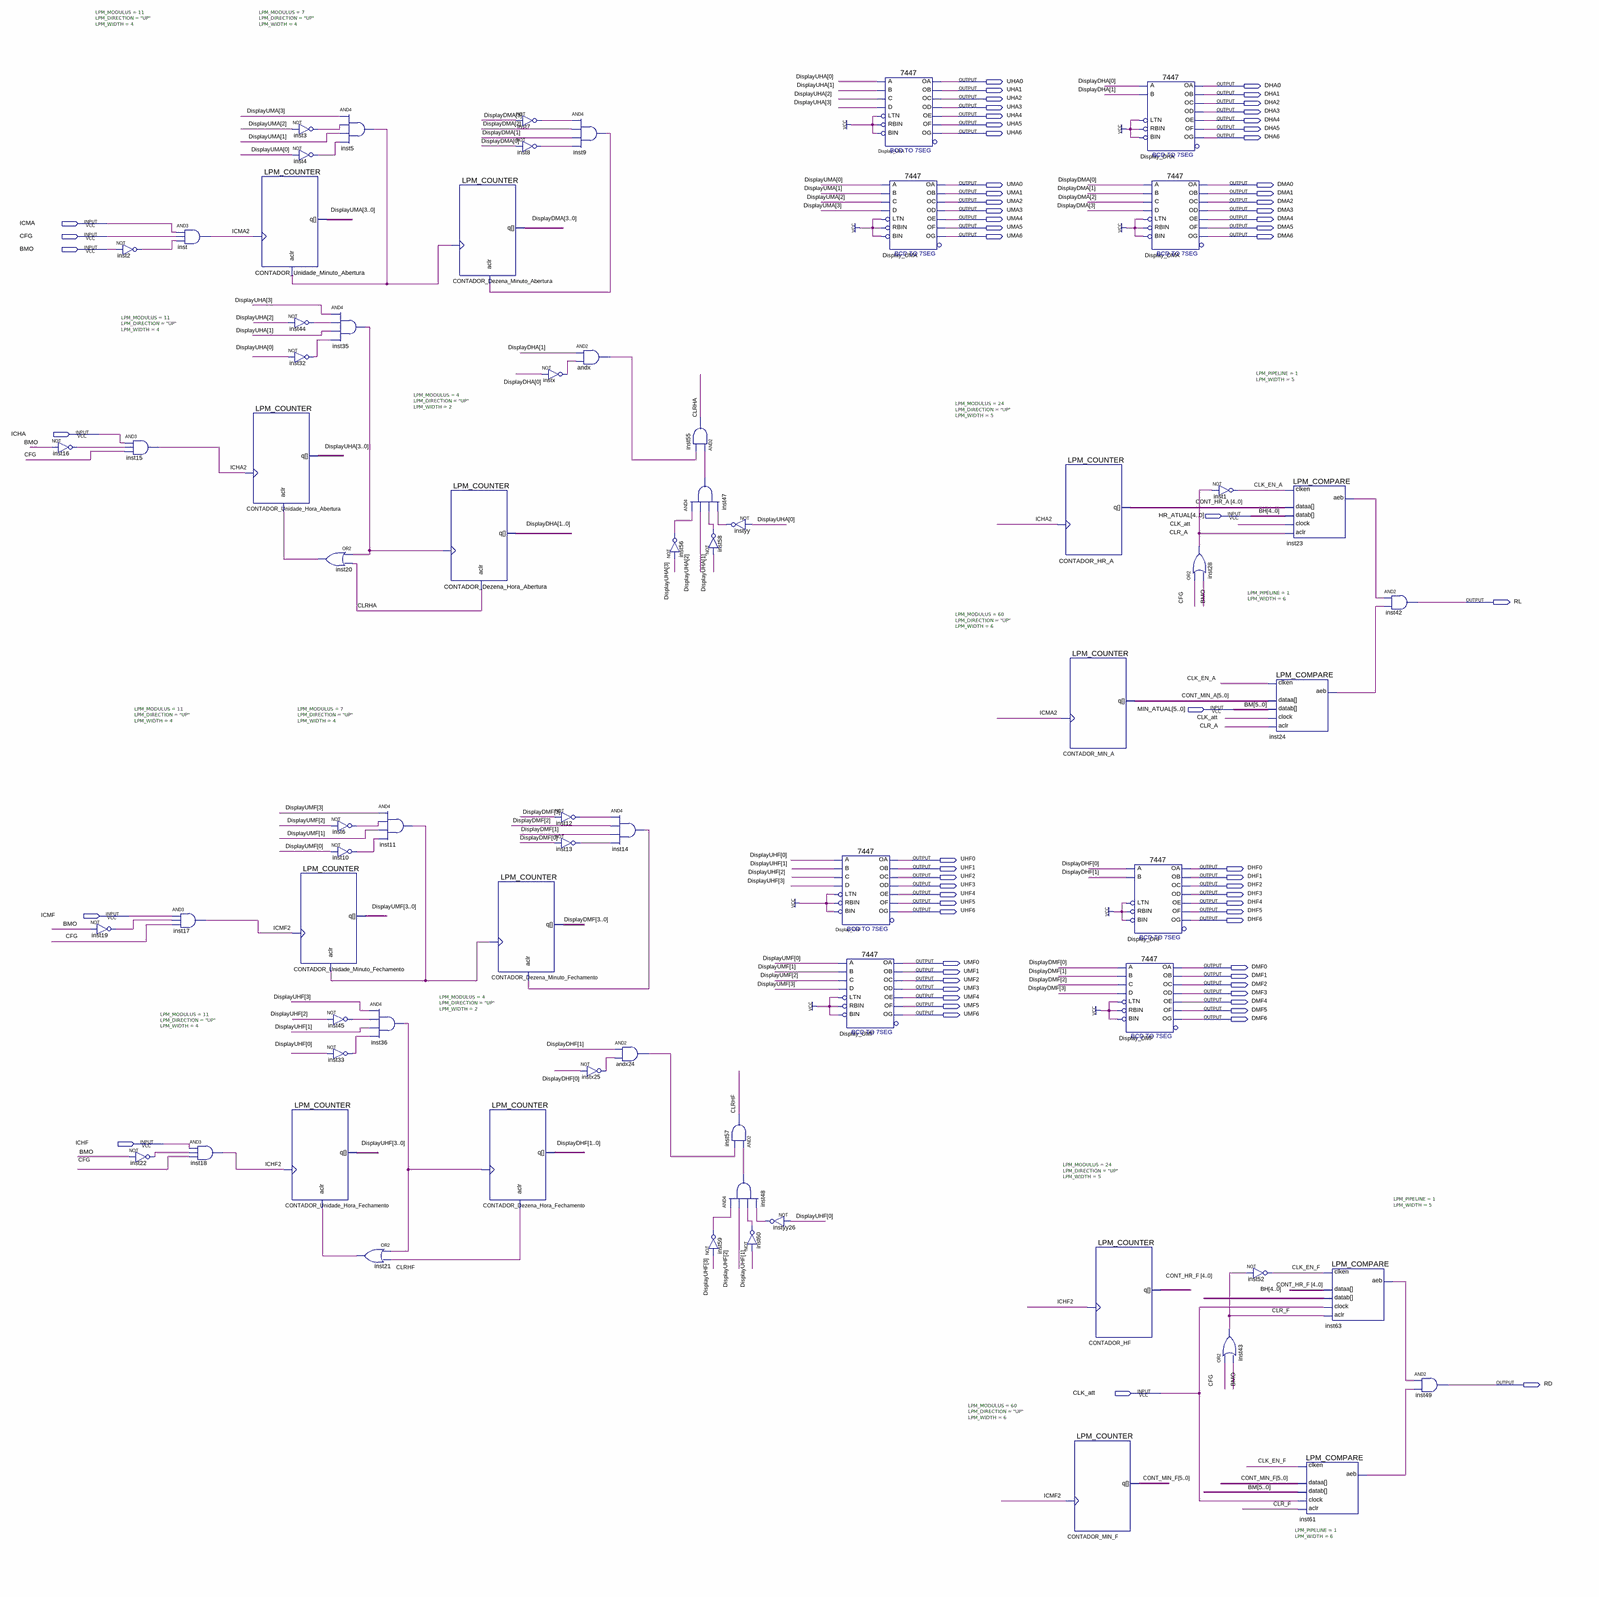
[diagram p0: schematic sheet, whole]
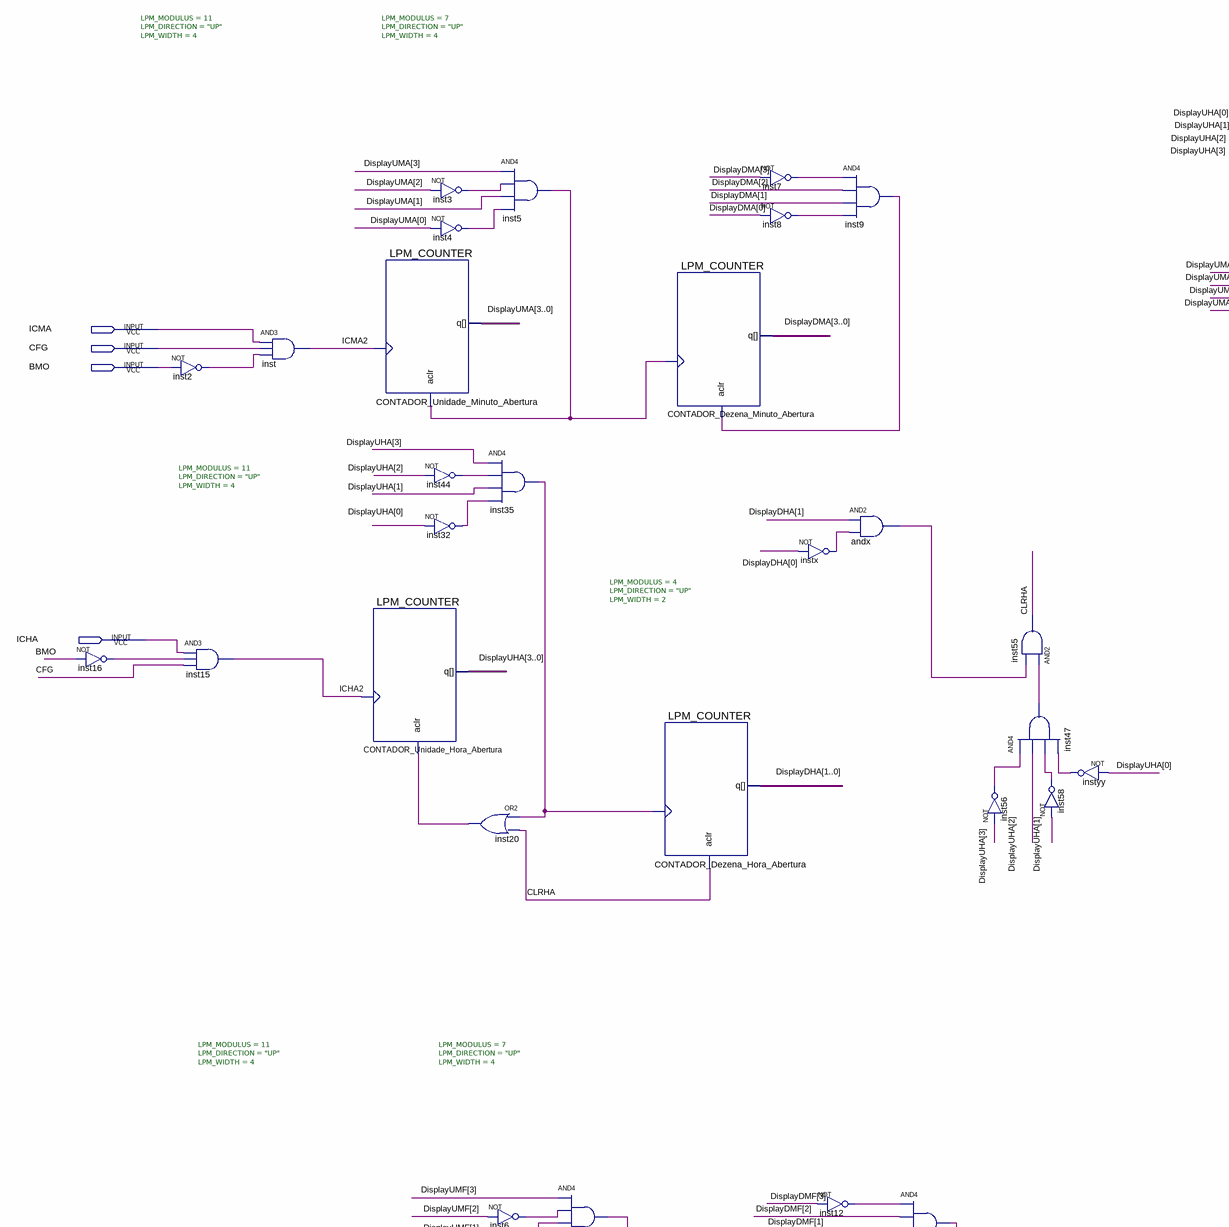
[diagram p1: schematic sheet, upper left part]
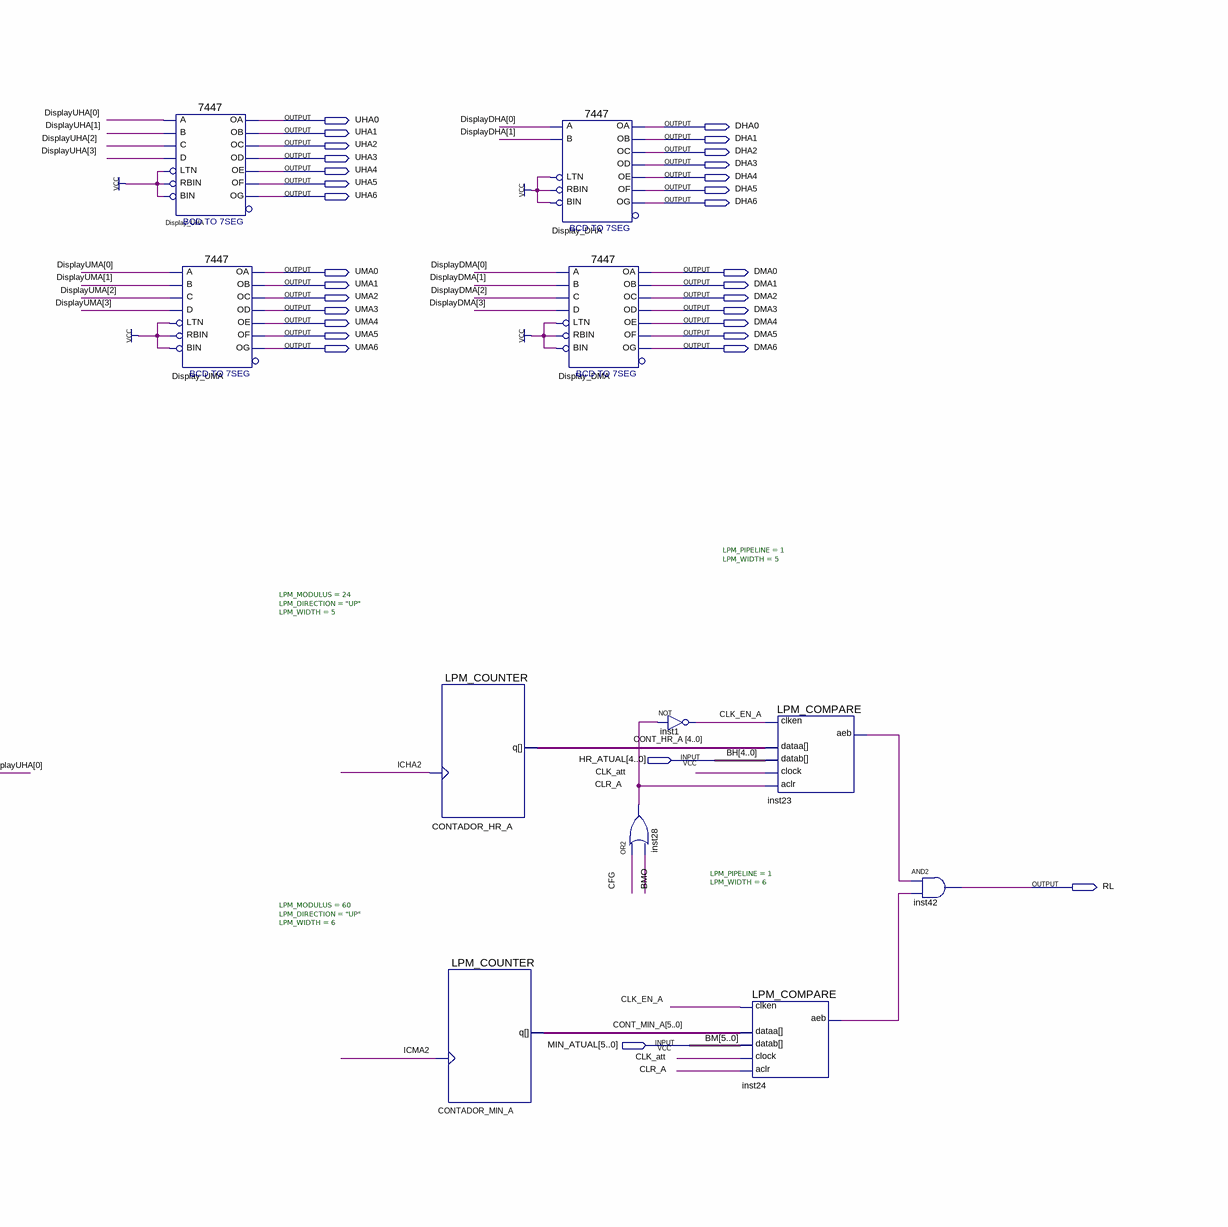
[diagram p2: schematic sheet, upper right part]
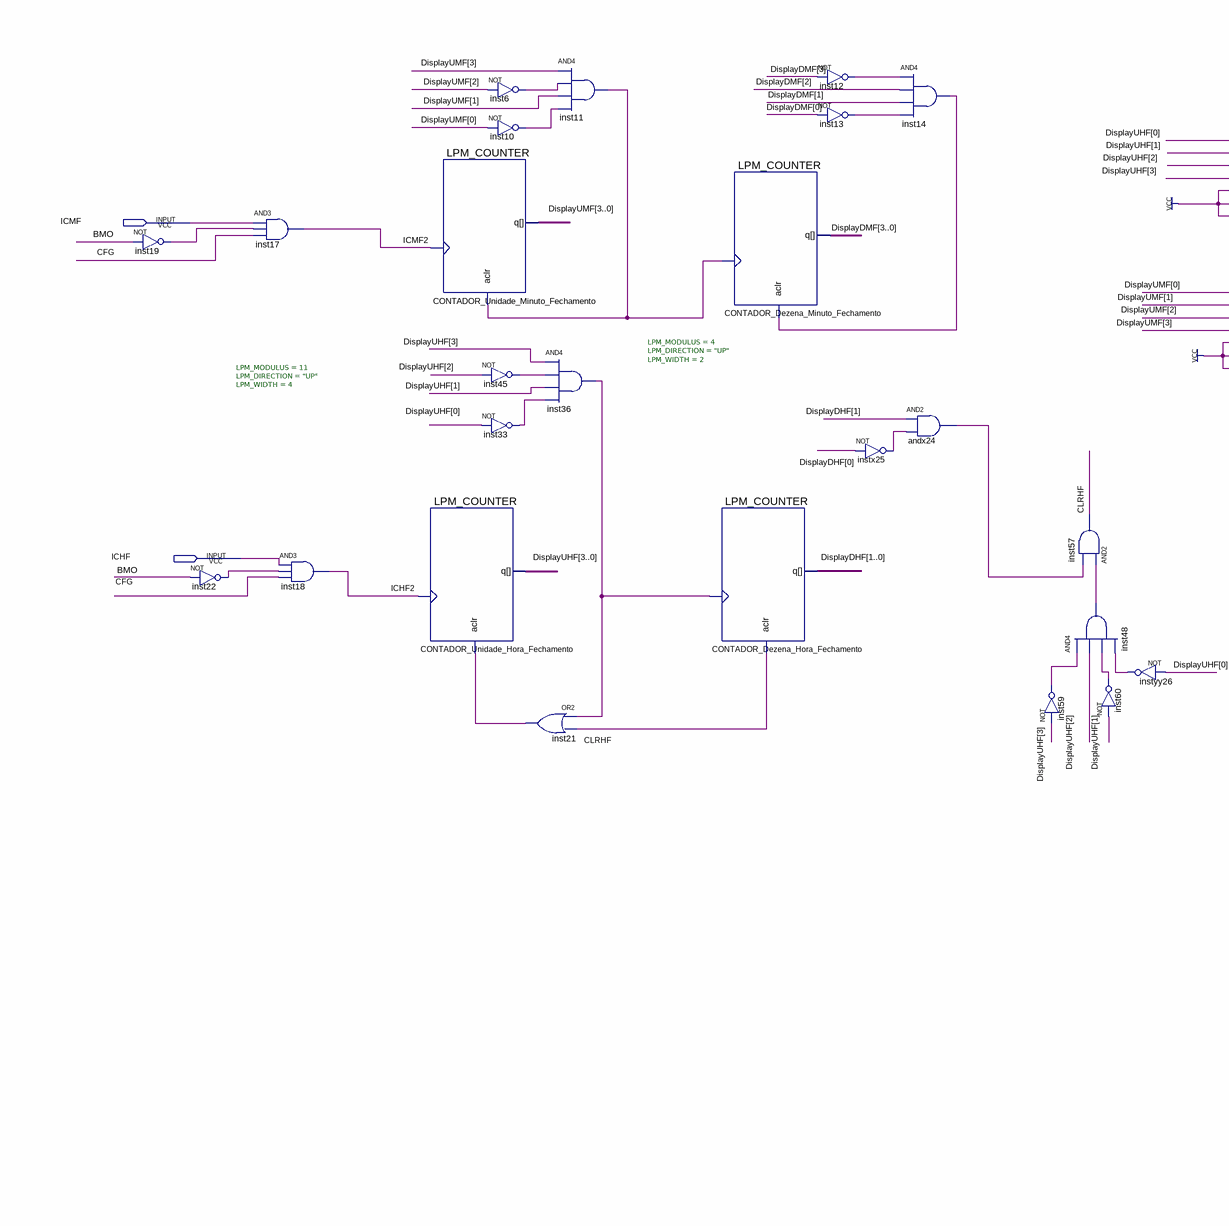
[diagram p3: schematic sheet, lower left part]
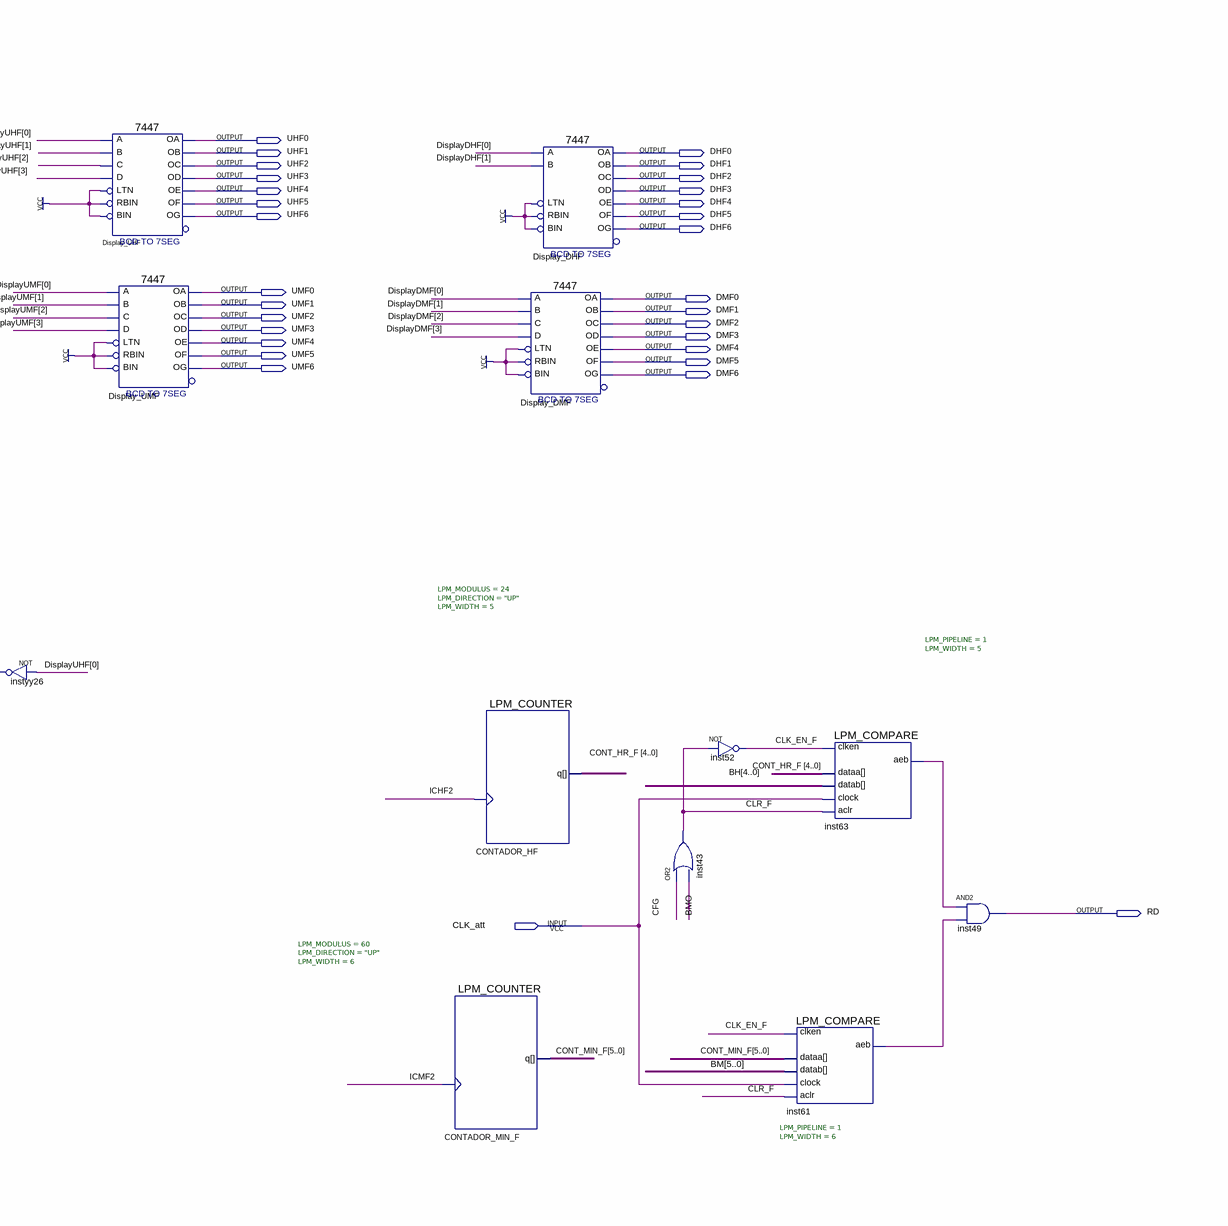
[diagram p4: schematic sheet, lower right part]
// Quartus schematic circuitoAutomatico.bdf as structural Verilog: 72 symbols, 67 pins
module circuitoAutomatico (
  input  ICMA,
  input  CFG,
  input  BMO,
  input  ICHA,
  input  [4:0] HR_ATUAL,
  input  [5:0] MIN_ATUAL,
  input  ICMF,
  input  ICHF,
  input  CLK_att,
  output UHA0,
  output DHA0,
  output UHA1,
  output DHA1,
  output UHA2,
  output DHA2,
  output UHA3,
  output DHA3,
  output UHA4,
  output DHA4,
  output UHA5,
  output DHA5,
  output UHA6,
  output DHA6,
  output UMA0,
  output DMA0,
  output UMA1,
  output DMA1,
  output UMA2,
  output DMA2,
  output UMA3,
  output DMA3,
  output UMA4,
  output DMA4,
  output UMA5,
  output DMA5,
  output UMA6,
  output DMA6,
  output RL,
  output UHF0,
  output UHF1,
  output DHF0,
  output UHF2,
  output DHF1,
  output UHF3,
  output DHF2,
  output UHF4,
  output DHF3,
  output UHF5,
  output DHF4,
  output UHF6,
  output DHF5,
  output DHF6,
  output UMF0,
  output DMF0,
  output UMF1,
  output DMF1,
  output UMF2,
  output DMF2,
  output UMF3,
  output DMF3,
  output UMF4,
  output DMF4,
  output UMF5,
  output DMF5,
  output UMF6,
  output DMF6,
  output RD
);

  wire andx24_out, andx_out, CLK_EN_A, CLK_EN_F, CLR_A, CLR_F, CLRHA, CLRHF, ICHA2, ICHF2, ICMA2, ICMF2,
       inst2_out, inst3_out, inst4_out, inst5_out, inst6_out, inst7_out, inst8_out, inst9_out, inst10_out,
       inst11_out, inst12_out, inst13_out, inst14_out, inst16_out, inst19_out, inst20_out, inst21_out,
       inst22_out, inst23_aeb, inst24_aeb, inst32_out, inst33_out, inst35_out, inst36_out, inst44_out,
       inst45_out, inst47_out, inst48_out, inst56_out, inst58_out, inst59_out, inst60_out, inst61_aeb,
       inst63_aeb, instx25_out, instx_out, instyy26_out, instyy_out;
  wire [1:0] DisplayDHA, DisplayDHF;
  wire [3:0] DisplayDMA, DisplayDMF, DisplayUHA, DisplayUHF, DisplayUMA, DisplayUMF;
  wire [4:0] CONT_HR_A, CONT_HR_F;
  wire [5:0] CONT_MIN_A, CONT_MIN_F;

  not inst16 (inst16_out, BMO);
  not inst19 (inst19_out, BMO);
  not inst2 (inst2_out, BMO);
  and inst15 (ICHA2, ICHA, inst16_out, CFG);
  not inst22 (inst22_out, BMO);
  and inst (ICMA2, ICMA, CFG, inst2_out);
  and inst17 (ICMF2, ICMF, inst19_out, CFG);
  and inst18 (ICHF2, ICHF, inst22_out, CFG);
  LPM_COUNTER #(.LPM_MODULUS(11), .LPM_DIRECTION("UP"), .LPM_WIDTH(4)) CONTADOR_Unidade_Hora_Abertura (
    .aclr(inst20_out), .clock(ICHA2), .q(DisplayUHA));
  LPM_COUNTER #(.LPM_MODULUS(11), .LPM_DIRECTION("UP"), .LPM_WIDTH(4)) CONTADOR_Unidade_Minuto_Abertura (
    .aclr(inst5_out), .clock(ICMA2), .q(DisplayUMA));
  LPM_COUNTER #(.LPM_MODULUS(11), .LPM_DIRECTION("UP"), .LPM_WIDTH(4)) CONTADOR_Unidade_Hora_Fechamento (
    .aclr(inst21_out), .clock(ICHF2), .q(DisplayUHF));
  not inst3 (inst3_out, DisplayUMA[2]);
  not inst4 (inst4_out, DisplayUMA[0]);
  not inst44 (inst44_out, DisplayUHA[2]);
  not inst32 (inst32_out, DisplayUHA[0]);
  or inst20 (inst20_out, inst35_out, CLRHA);
  LPM_COUNTER #(.LPM_MODULUS(11), .LPM_DIRECTION("UP"), .LPM_WIDTH(4)) CONTADOR_Unidade_Minuto_Fechamento (
    .aclr(inst11_out), .clock(ICMF2), .q(DisplayUMF));
  and inst5 (inst5_out, DisplayUMA[3], inst3_out, DisplayUMA[1], inst4_out);
  and inst35 (inst35_out, DisplayUHA[3], inst44_out, DisplayUHA[1], inst32_out);
  not inst6 (inst6_out, DisplayUMF[2]);
  not inst10 (inst10_out, DisplayUMF[0]);
  not inst45 (inst45_out, DisplayUHF[2]);
  not inst33 (inst33_out, DisplayUHF[0]);
  and inst11 (inst11_out, DisplayUMF[3], inst6_out, DisplayUMF[1], inst10_out);
  and inst36 (inst36_out, DisplayUHF[3], inst45_out, DisplayUHF[1], inst33_out);
  or inst21 (inst21_out, inst36_out, CLRHF);
  LPM_COUNTER #(.LPM_MODULUS(7), .LPM_DIRECTION("UP"), .LPM_WIDTH(4)) CONTADOR_Dezena_Minuto_Abertura (
    .aclr(inst9_out), .clock(inst5_out), .q(DisplayDMA));
  LPM_COUNTER #(.LPM_MODULUS(4), .LPM_DIRECTION("UP"), .LPM_WIDTH(2)) CONTADOR_Dezena_Hora_Abertura (
    .aclr(CLRHA), .clock(inst35_out), .q(DisplayDHA));
  LPM_COUNTER #(.LPM_MODULUS(7), .LPM_DIRECTION("UP"), .LPM_WIDTH(4)) CONTADOR_Dezena_Minuto_Fechamento (
    .aclr(inst14_out), .clock(inst11_out), .q(DisplayDMF));
  LPM_COUNTER #(.LPM_MODULUS(4), .LPM_DIRECTION("UP"), .LPM_WIDTH(2)) CONTADOR_Dezena_Hora_Fechamento (
    .aclr(CLRHF), .clock(inst36_out), .q(DisplayDHF));
  not inst7 (inst7_out, DisplayDMA[3]);
  not inst8 (inst8_out, DisplayDMA[0]);
  not instx (instx_out, DisplayDHA[0]);
  not inst12 (inst12_out, DisplayDMF[3]);
  not inst13 (inst13_out, DisplayDMF[0]);
  and inst9 (inst9_out, inst7_out, DisplayDMA[2], DisplayDMA[1], inst8_out);
  and andx (andx_out, DisplayDHA[1], instx_out);
  not instx25 (instx25_out, DisplayDHF[0]);
  and inst14 (inst14_out, inst12_out, DisplayDMF[2], DisplayDMF[1], inst13_out);
  and andx24 (andx24_out, DisplayDHF[1], instx25_out);
  and inst55 (CLRHA, inst47_out, andx_out);
  and inst47 (inst47_out, inst56_out, DisplayUHA[2], inst58_out, instyy_out);
  not inst56 (inst56_out, DisplayUHA[3]);
  not instyy (instyy_out, DisplayUHA[0]);
  not inst58 (inst58_out, DisplayUHA[1]);
  and inst57 (CLRHF, inst48_out, andx24_out);
  and inst48 (inst48_out, inst59_out, DisplayUHF[2], inst60_out, instyy26_out);
  not inst59 (inst59_out, DisplayUHF[3]);
  not instyy26 (instyy26_out, DisplayUHF[0]);
  not inst60 (inst60_out, DisplayUHF[1]);
  \7447  Display_UHF (
    .A(DisplayUHF[0]), .B(DisplayUHF[1]), .BIN(1'b1), .C(DisplayUHF[2]), .D(DisplayUHF[3]), .LTN(1'b1),
    .RBIN(1'b1), .OA(UHF0), .OB(UHF1), .OC(UHF2), .OD(UHF3), .OE(UHF4), .OF(UHF5), .OG(UHF6));
  \7447  Display_UMF (
    .A(DisplayUMF[0]), .B(DisplayUMF[1]), .BIN(1'b1), .C(DisplayUMF[2]), .D(DisplayUMF[3]), .LTN(1'b1),
    .RBIN(1'b1), .OA(UMF0), .OB(UMF1), .OC(UMF2), .OD(UMF3), .OE(UMF4), .OF(UMF5), .OG(UMF6));
  \7447  Display_UHA (
    .A(DisplayUHA[0]), .B(DisplayUHA[1]), .BIN(1'b1), .C(DisplayUHA[2]), .D(DisplayUHA[3]), .LTN(1'b1),
    .RBIN(1'b1), .OA(UHA0), .OB(UHA1), .OC(UHA2), .OD(UHA3), .OE(UHA4), .OF(UHA5), .OG(UHA6));
  \7447  Display_UMA (
    .A(DisplayUMA[0]), .B(DisplayUMA[1]), .BIN(1'b1), .C(DisplayUMA[2]), .D(DisplayUMA[3]), .LTN(1'b1),
    .RBIN(1'b1), .OA(UMA0), .OB(UMA1), .OC(UMA2), .OD(UMA3), .OE(UMA4), .OF(UMA5), .OG(UMA6));
  LPM_COUNTER #(.LPM_MODULUS(24), .LPM_DIRECTION("UP"), .LPM_WIDTH(5)) CONTADOR_HR_A (.clock(ICHA2), .q(CONT_HR_A));
  LPM_COUNTER #(.LPM_MODULUS(60), .LPM_DIRECTION("UP"), .LPM_WIDTH(6)) CONTADOR_MIN_A (.clock(ICMA2), .q(CONT_MIN_A));
  LPM_COUNTER #(.LPM_MODULUS(60), .LPM_DIRECTION("UP"), .LPM_WIDTH(6)) CONTADOR_MIN_F (.clock(ICMF2), .q(CONT_MIN_F));
  LPM_COUNTER #(.LPM_MODULUS(24), .LPM_DIRECTION("UP"), .LPM_WIDTH(5)) CONTADOR_HF (.clock(ICHF2), .q(CONT_HR_F));
  \7447  Display_DHA (
    .A(DisplayDHA[0]), .B(DisplayDHA[1]), .BIN(1'b1), .LTN(1'b1), .RBIN(1'b1), .OA(DHA0), .OB(DHA1),
    .OC(DHA2), .OD(DHA3), .OE(DHA4), .OF(DHA5), .OG(DHA6));
  \7447  Display_DMA (
    .A(DisplayDMA[0]), .B(DisplayDMA[1]), .BIN(1'b1), .C(DisplayDMA[2]), .D(DisplayDMA[3]), .LTN(1'b1),
    .RBIN(1'b1), .OA(DMA0), .OB(DMA1), .OC(DMA2), .OD(DMA3), .OE(DMA4), .OF(DMA5), .OG(DMA6));
  \7447  Display_DHF (
    .A(DisplayDHF[0]), .B(DisplayDHF[1]), .BIN(1'b1), .LTN(1'b1), .RBIN(1'b1), .OA(DHF0), .OB(DHF1),
    .OC(DHF2), .OD(DHF3), .OE(DHF4), .OF(DHF5), .OG(DHF6));
  \7447  Display_DMF (
    .A(DisplayDMF[0]), .B(DisplayDMF[1]), .BIN(1'b1), .C(DisplayDMF[2]), .D(DisplayDMF[3]), .LTN(1'b1),
    .RBIN(1'b1), .OA(DMF0), .OB(DMF1), .OC(DMF2), .OD(DMF3), .OE(DMF4), .OF(DMF5), .OG(DMF6));
  not inst1 (CLK_EN_A, CLR_A);
  or inst28 (CLR_A, CFG, BMO);
  not inst52 (CLK_EN_F, CLR_F);
  or inst43 (CLR_F, CFG, BMO);
  LPM_COMPARE #(.LPM_PIPELINE(1), .LPM_WIDTH(6)) inst24 (
    .aclr(CLR_A), .clken(CLK_EN_A), .clock(CLK_att), .dataa(CONT_MIN_A), .datab(MIN_ATUAL), .aeb(inst24_aeb));
  LPM_COMPARE #(.LPM_PIPELINE(1), .LPM_WIDTH(5)) inst23 (
    .aclr(CLR_A), .clken(CLK_EN_A), .clock(CLK_att), .dataa(CONT_HR_A), .datab(HR_ATUAL), .aeb(inst23_aeb));
  LPM_COMPARE #(.LPM_PIPELINE(1), .LPM_WIDTH(6)) inst61 (
    .aclr(CLR_F), .clken(CLK_EN_F), .clock(CLK_att), .dataa(CONT_MIN_F), .datab(MIN_ATUAL), .aeb(inst61_aeb));
  LPM_COMPARE #(.LPM_PIPELINE(1), .LPM_WIDTH(5)) inst63 (
    .aclr(CLR_F), .clken(CLK_EN_F), .clock(CLK_att), .dataa(CONT_HR_F), .datab(HR_ATUAL), .aeb(inst63_aeb));
  and inst42 (RL, inst23_aeb, inst24_aeb);
  and inst49 (RD, inst63_aeb, inst61_aeb);

  // Other names for the same wires on the sheet: BH[4:0] = HR_ATUAL; BM[5:0] = MIN_ATUAL
endmodule
